# EAGLE design untitled (EAGLE 9.6.2)
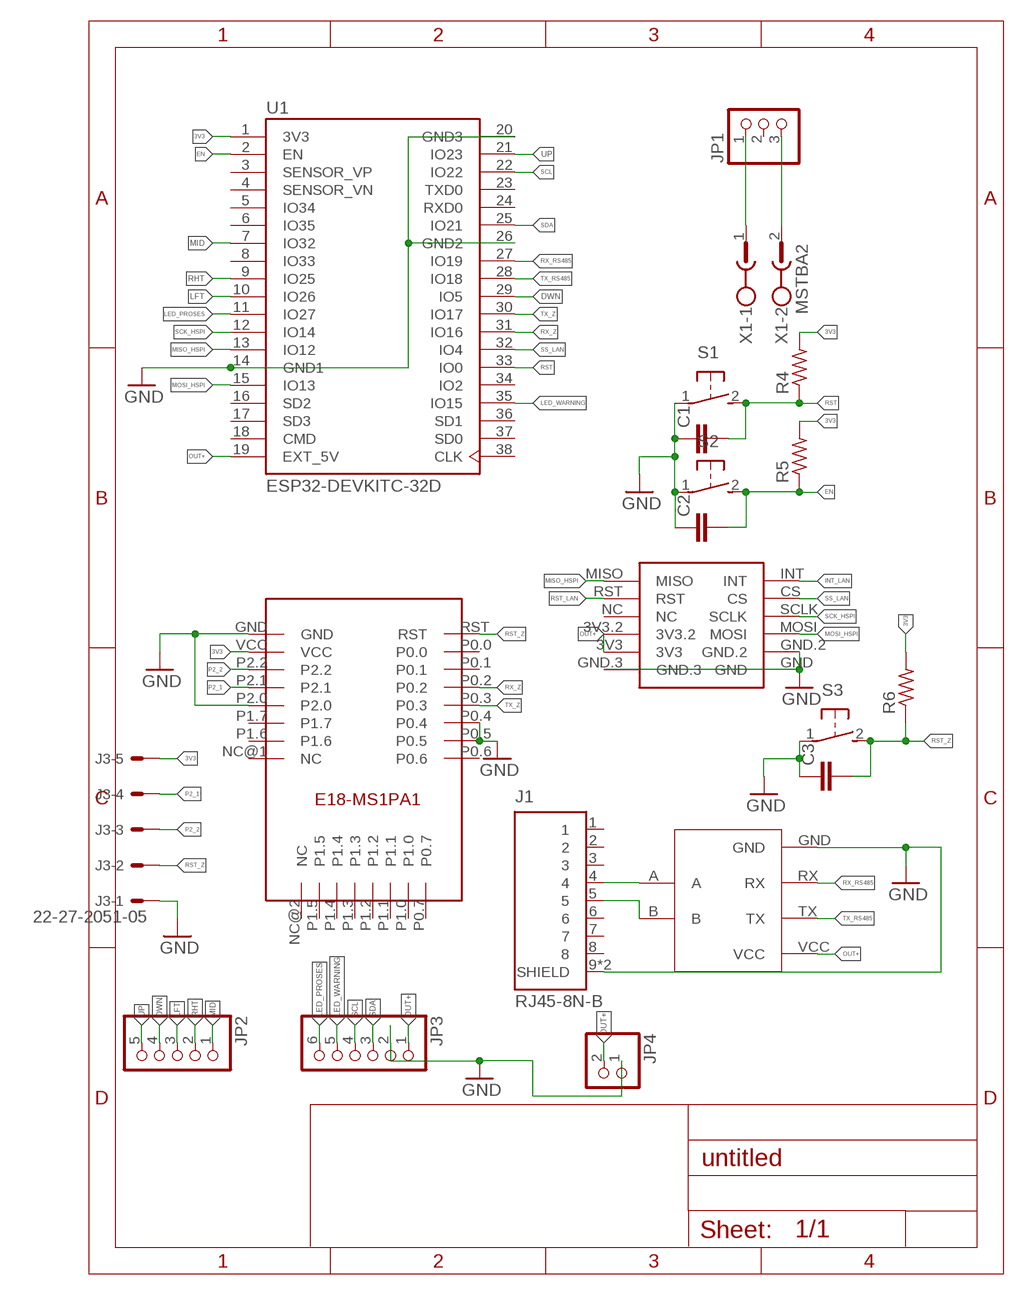
[diagram p0: schematic, sheet 1]

## Parts
C1  C-EUC0805K  [C0805K]
C2  C-EUC0805K  [C0805K]
C3  C-EUC0805K  [C0805K]
J1  RJ45-8N-B  [TE_RJ45-8N-B]
J3  22-27-2051-05  [6410-05]
JP1  PINHD-1X3  [1X03]
JP2  PINHD-1X5  [1X05]
JP3  PINHD-1X6  [1X06]
JP4  PINHD-1X2  [1X02]
R4  R-US_M0805  [M0805]
R5  R-US_M0805  [M0805]
R6  R-US_M0805  [M0805]
S1  31-XX  [B3F-31XX]
S2  31-XX  [B3F-31XX]
S3  31-XX  [B3F-31XX]
TTL-RS1  TTL-RS485  [TTL-RS485]
U1  ESP32-DEVKITC-32D  [MODULE_ESP32-DEVKITC-32D]
U$1  E18-MS1PA1IPX  [E18-MS1PA1-IPX]
U$2  MINI_W5500  [MINI_W5500]
X1  MSTBA2  [MSTBA2]

## Nets
3V3: J3.5 R4.2 R5.2 R6.2 U1.1(3V3) U$1.VCC
DWN: JP2.4 U1.29(IO5)
EN: C2.2 R5.1 S2.2(S) U1.2(EN)
GND: C1.1 C2.1 C3.1 J1.9(SHIELD) J1.10(SHIELD) J3.1 JP3.2 JP4.1 S1.1(P) S2.1(P) S3.1(P) TTL-RS1.GND U1.14(GND1) U1.20(GND3) U1.26(GND2) U$1.GND U$1.P0.4 U$1.P0.5 U$1.P2.0 U$2.GND U$2.GND.2 U$2.GND.3
INT_LAN: U$2.INT
LED_PROSES: JP3.6 U1.11(IO27)
LED_WARNING: JP3.5 U1.35(IO15)
LFT: JP2.3 U1.10(IO26)
MID: JP2.1 U1.7(IO32)
MISO_HSPI: U1.13(IO12) U$2.MISO
MOSI_HSPI: U1.15(IO13) U$2.MOSI
N$1: JP1.1 X1.1
N$2: JP1.3 X1.2
N$3: J1.4 TTL-RS1.A
N$7: J1.5 TTL-RS1.B
OUT+: JP3.1 JP4.2 TTL-RS1.VCC U1.19(EXT_5V) U$2.3V3 U$2.3V3.2
P2_1: J3.4 U$1.P2.1
P2_2: J3.3 U$1.P2.2
RHT: JP2.2 U1.9(IO25)
RST: C1.2 R4.1 S1.2(S) U1.33(IO0)
RST_LAN: U$2.RST
RST_Z: C3.2 J3.2 R6.1 S3.2(S) U$1.RST
RX_RS485: TTL-RS1.RX U1.27(IO19)
RX_Z: U1.31(IO16) U$1.P0.2
SCK_HSPI: U1.12(IO14) U$2.SCLK
SCL: JP3.4 U1.22(IO22)
SDA: JP3.3 U1.25(IO21)
SS_LAN: U1.32(IO4) U$2.CS
TX_RS485: TTL-RS1.TX U1.28(IO18)
TX_Z: U1.30(IO17) U$1.P0.3
UP: JP2.5 U1.21(IO23)
Unconnected: J1.1 J1.2 J1.3 J1.6 J1.7 J1.8 JP1.2 U1.3(SENSOR_VP) U1.4(SENSOR_VN) U1.5(IO34) U1.6(IO35) U1.8(IO33) U1.16(SD2) U1.17(SD3) U1.18(CMD) U1.23(TXD0) U1.24(RXD0) U1.34(IO2) U1.36(SD1) U1.37(SD0) U1.38(CLK) U$1.NC@1(NC) U$1.NC@2(NC) U$1.P0.0 U$1.P0.1 U$1.P0.6 U$1.P0.7 U$1.P1.0 U$1.P1.1 U$1.P1.2 U$1.P1.3 U$1.P1.4 U$1.P1.5 U$1.P1.6 U$1.P1.7 U$2.NC

## Library data of the parts
C1-C3 = rcl:C-EU: CAPACITOR, European symbol; SPICEPREFIX: C
J1 = RJ45-8N-B:RJ45-8N-B: RJ Jack / Signal Line EMI/RFI Filters 6 TERM LOW PROFILE BLOCK INDUCTOR 8 PIN Check availability <https://pricing.snapeda.com/parts/RJ45-8N-B/TE%20Connectivity/view-part?ref=eda>; AVAILABILITY: In Stock; DESCRIPTION: Jack Modular Connector 8p8c (RJ45, Ethernet) 90° Angle (Right) Unshielded -; MF: TE Connectivity; MP: RJ45-8N-B; PACKAGE: None; PRICE: None; PURCHASE-URL: https://pricing.snapeda.com/search/part/RJ45-8N-B/?ref=eda
J3 = con-molex:22-?-05: CONNECTOR wire to board 2.54 mm (.1 inch) pitch header; MF: MOLEX; OC_FARNELL: unknown; OC_NEWARK: unknown
JP1 = pinhead:PINHD-1X3: PIN HEADER
JP2 = pinhead:PINHD-1X5: PIN HEADER
JP3 = pinhead:PINHD-1X6: PIN HEADER
JP4 = pinhead:PINHD-1X2: PIN HEADER
R4-R6 = adafruit:R-US_: RESISTOR, American symbol
S1-S3 = switch-omron:31-XX: OMRON SWITCH; MPN: B3F-3100; OC_FARNELL: 959704; OC_NEWARK: 36M3582
TTL-RS1 = TTL-RS485:TTL-RS485
U1 = ESP32-DEVKITC-32D:ESP32-DEVKITC-32D: Eval Board For Esp-Wroom-32 Check availability <https://pricing.snapeda.com/parts/ESP32-DEVKITC-32D/Espressif%20Systems/view-part?ref=eda>; AVAILABILITY: In Stock; DESCRIPTION: WiFi Development Tools (802.11) ESP32 General Development Kit, ESP32-WROOM-32D on the board; MF: Espressif Systems; MP: ESP32-DEVKITC-32D; PACKAGE: None; PRICE: None; PURCHASE-URL: https://pricing.snapeda.com/search/part/ESP32-DEVKITC-32D/?ref=eda
U$1 = e18-ms1pa1-ipx:E18-MS1PA1
U$2 = ethernet-mikroavr:MINI_W5500: MINI ETHERNET W5500, CREATE BY MIKROAVR.COM
X1 = con-phoenix-508:MSTBA2: PHOENIX; MF: FARNELL; MPN: 1757242; OC_FARNELL: 3705171; OC_NEWARK: 71C4161

## Board
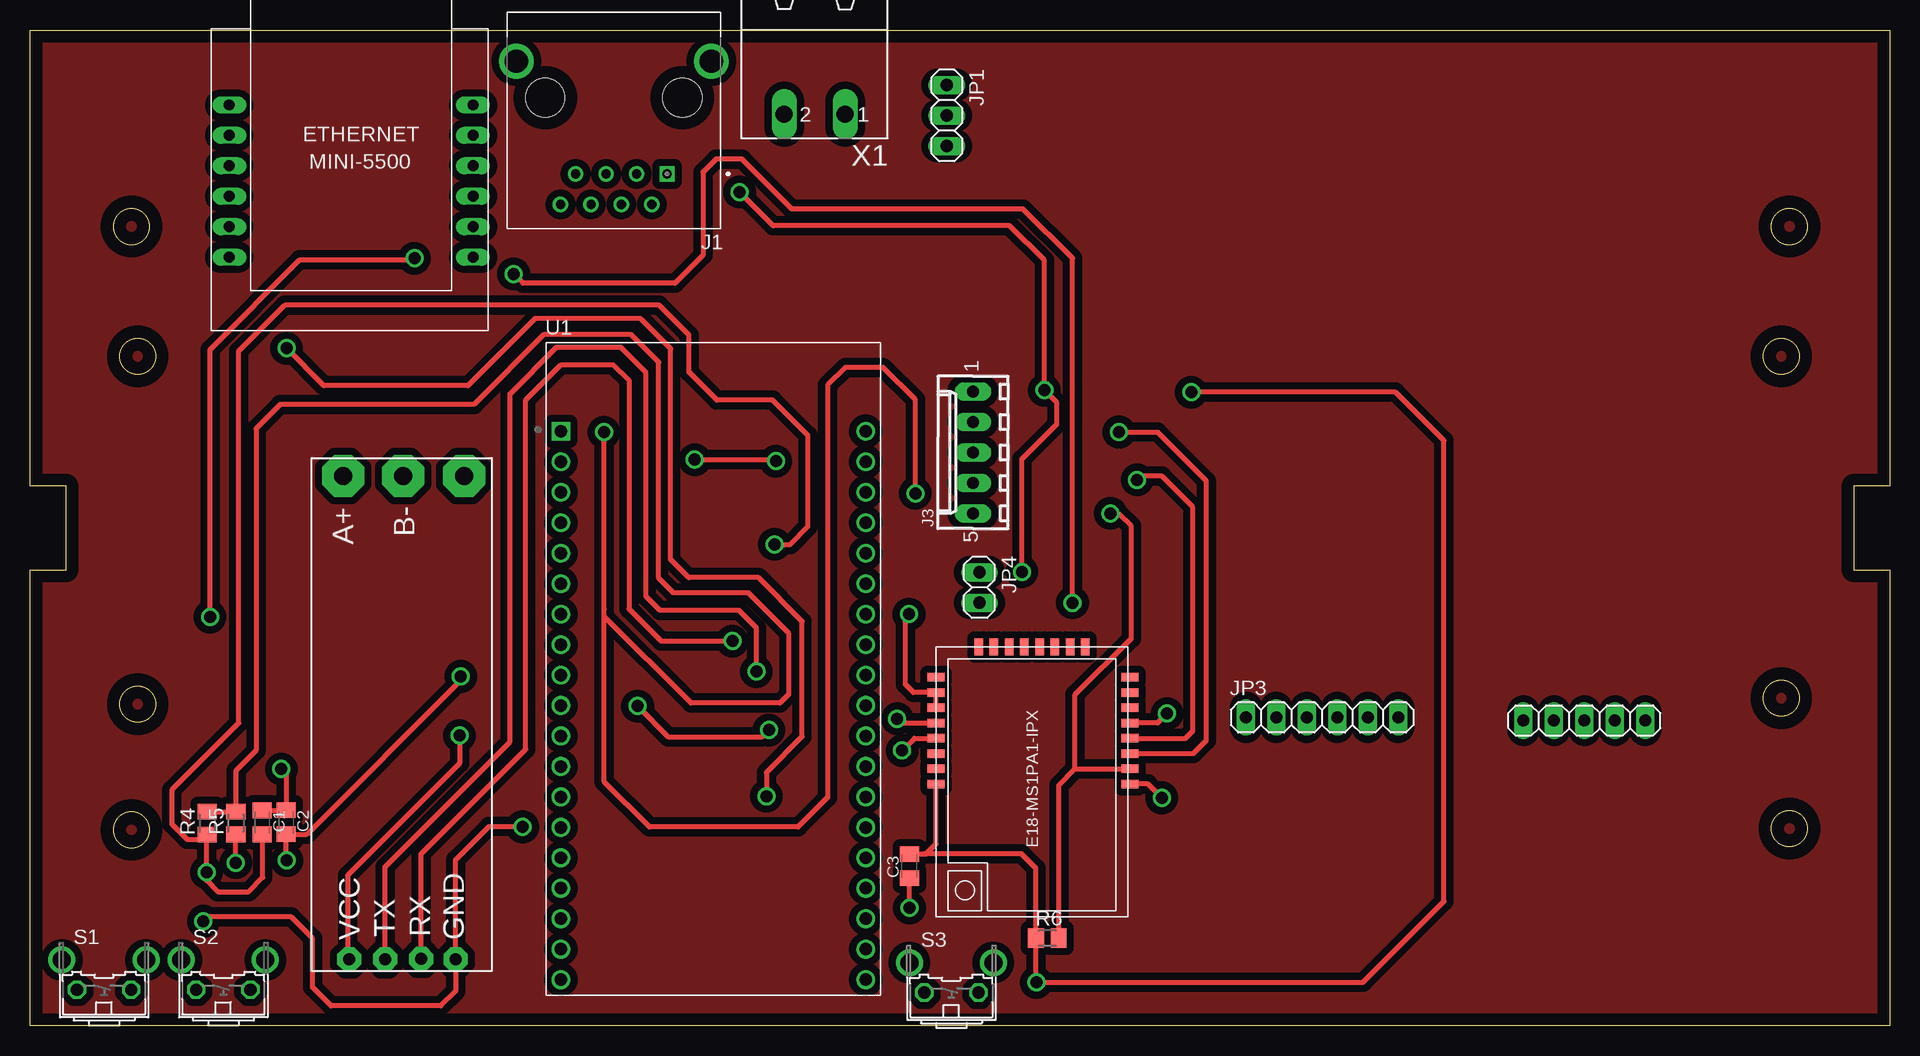
[diagram p1: board, top side]
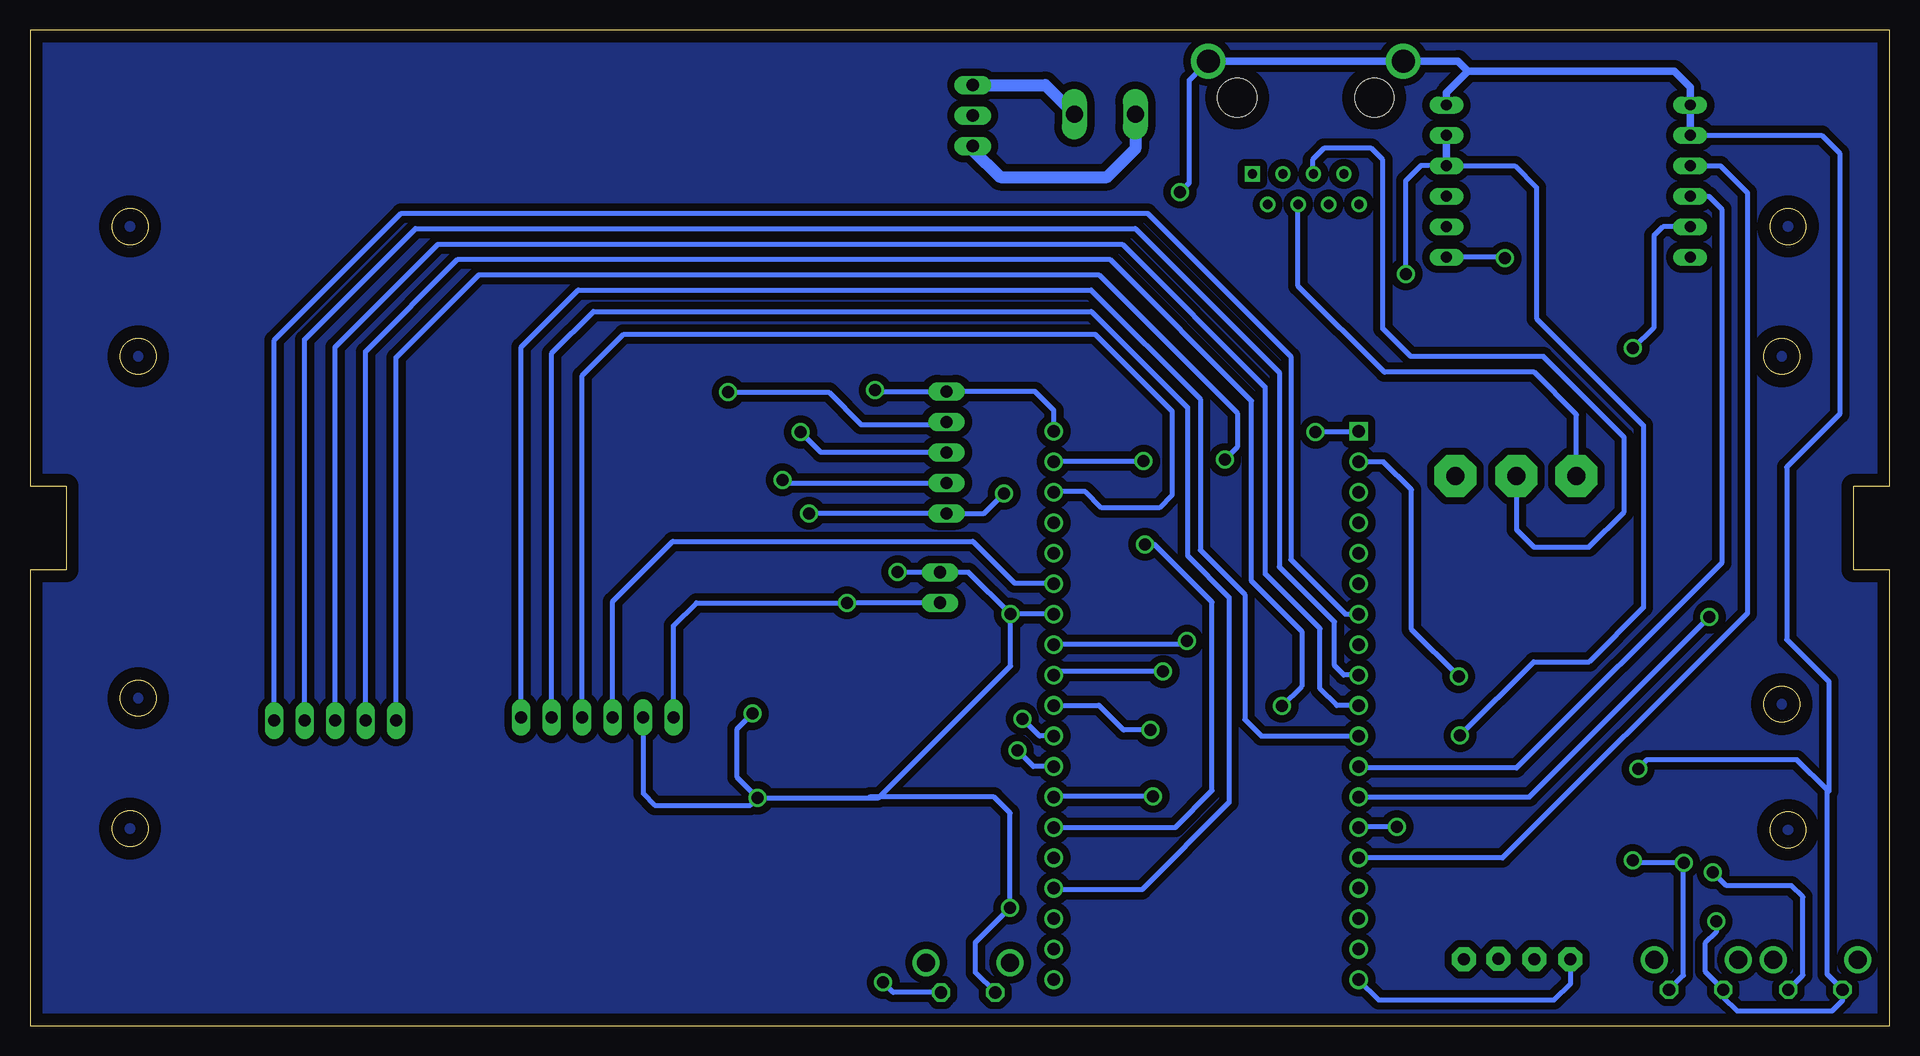
[diagram p2: board, bottom side, seen from below]

Size 155 x 83 mm. Coordinates in mm from the lower left corner, seen from the top.
Outline: 0,0 0,38 3,38 3,45 0,45 0,83 155,83 155,45 152,45 152,38 155,38 155,0 0,0
Outline: circle at 146.66,66.62 radius 1.5
Outline: circle at 146.66,16.42 radius 1.5
Outline: circle at 8.46,16.32 radius 1.5
Outline: circle at 8.46,66.62 radius 1.5
Outline: circle at 8.98,26.79 radius 1.5
Outline: circle at 8.98,55.79 radius 1.5
Outline: circle at 145.98,27.29 radius 1.5
Outline: circle at 145.98,55.79 radius 1.5
Copper layers (1*16): Top 0.035mm / dielectric 1.5mm / Bottom 0.035mm
Design rules "default": minimum track width 6mil, minimum drill 0.35mm, track to track 6mil, track to pad 6mil, pad to pad 6mil, via to via 6mil, smd to smd 6mil, copper to edge 40mil, drill to drill 6mil, minimum pad ring 10mil, minimum via ring 8mil, stop-mask expansion 4mil, vias tented up to drill 0mil, thermal gap 10mil

### Footprints (pad centres in the part's own frame; a part is rotated, then mirrored left to right if it is on the bottom)
C0805K = smd 1.3 x 1.6: 1 -1,0; 2 1,0
TE_RJ45-8N-B = drill 0.76 square: 1 -4.445,6.35 | drill 0.76: 2 -3.175,8.89; 3 -1.905,6.35; 4 -0.635,8.89; 5 0.635,6.35; 6 1.905,8.89; 7 3.175,6.35; 8 4.445,8.89 | drill 1.93: 9 -8.125,-3.05; 10 8.125,-3.05 | hole 3.25: -5.715,0; 5.715,0
6410-05 = drill 1.016 long: 1 5.08,0; 2 2.54,0; 3 0,0; 4 -2.54,0; 5 -5.08,0
1X03 = drill 1.016 long: 1 -2.54,0; 2 0,0; 3 2.54,0
1X05 = drill 1.016 long: 1 -5.08,0; 2 -2.54,0; 3 0,0; 4 2.54,0; 5 5.08,0
1X06 = drill 1.016 long: 1 -6.35,0; 2 -3.81,0; 3 -1.27,0; 4 1.27,0; 5 3.81,0; 6 6.35,0
1X02 = drill 1.016 long: 1 -1.27,0; 2 1.27,0
M0805 = smd 1.3 x 1.6: 1 -0.95,0; 2 0.95,0
B3F-31XX = drill 1.016 octagon: 1 -2.261,-1.245; 2 2.261,-1.245 | drill 1.499 pad 2.159: 3 -3.505,1.245; 4 3.505,1.245
TTL-RS485 = drill 1.5 pad 3.5 octagon: A -19.7,-6; B -19.7,-1; P$7 -19.7,4.1 | drill 1 pad 2 octagon: GND 20.6,3.37; RX 20.581,0.505; TX 20.583,-2.493; VCC 20.6,-5.47
MODULE_ESP32-DEVKITC-32D = drill 1.04 square: 1 -12.7,19.76 | drill 1.04: 2 -12.7,17.22; 3 -12.7,14.68; 4 -12.7,12.14; 5 -12.7,9.6; 6 -12.7,7.06; 7 -12.7,4.52; 8 -12.7,1.98; 9 -12.7,-0.56; 10 -12.7,-3.1; 11 -12.7,-5.64; 12 -12.7,-8.18; 13 -12.7,-10.72; 14 -12.7,-13.26; 15 -12.7,-15.8; 16 -12.7,-18.34; 17 -12.7,-20.88; 18 -12.7,-23.42; 19 -12.7,-25.96; 20 12.7,19.76; 21 12.7,17.22; 22 12.7,14.68; 23 12.7,12.14; 24 12.7,9.6; 25 12.7,7.06; 26 12.7,4.52; 27 12.7,1.98; 28 12.7,-0.56; 29 12.7,-3.1; 30 12.7,-5.64; 31 12.7,-8.18; 32 12.7,-10.72; 33 12.7,-13.26; 34 12.7,-15.8; 35 12.7,-18.34; 36 12.7,-20.88; 37 12.7,-23.42; 38 12.7,-25.96
E18-MS1PA1-IPX = smd 0.711 x 1.422: GND 11.44,16.14; NC@1 2.55,16.14; P0.0 10.17,0; P0.1 8.9,0; P0.2 7.63,0; P0.3 6.36,0; P0.4 5.09,0; P0.5 3.82,0; P0.6 2.55,0; P1.6 3.82,16.14; P1.7 5.09,16.14; P2.0 6.36,16.14; P2.1 7.63,16.14; P2.2 8.9,16.14; RST 11.44,0; VCC 10.17,16.14 | smd 1.422 x 0.711: NC@2 0,12.44; P0.7 0,3.55; P1.0 0,4.82; P1.1 0,6.09; P1.2 0,7.36; P1.3 0,8.63; P1.4 0,9.9; P1.5 0,11.17
MINI_W5500 = drill 0.914 long: 3V3 21.844,-8.89; 3V3.2 21.844,-11.43; CS 1.524,-16.51; GND 1.524,-6.35; GND.2 1.524,-8.89; GND.3 21.844,-6.35; INT 1.524,-19.05; MISO 21.844,-19.05; MOSI 1.524,-11.43; NC 21.844,-13.97; RST 21.844,-16.51; SCLK 1.524,-13.97
MSTBA2 = drill 1.397 long: 1 -2.54,5.08; 2 2.54,5.08

### Placement (x,y rotation side)
C1  19.35,16.94 270 top
C2  21.35,16.95 270 top
C3  73.3,13.3 90 top
J1  48.66,77.35 180 top
J3  78.6,47.78 90 top
JP1  76.42,75.87 270 top
JP2  129.57,25.42 180 top
JP3  107.7,25.69 0 top
JP4  79.14,36.52 270 top
R4  14.77,16.87 90 top
R5  17.17,16.89 90 top
R6  84.8,7.3 0 top
S1  6.17,4.23 0 top
S2  16.11,4.23 0 top
S3  76.8,4 0 top
TTL-RS1  32.09,26.12 270 top
U1  56.96,29.78 0 top
U$1  75.53,31.58 270 top
U$2  15.09,83.1 0 top
X1  65.4,81.06 180 top

### Tracks (layer width: path | path; a pad name or v marks a point on that pad's centre or on a via)
3V3  (via drill 1)
  Top 0.406: R4.2 17.15,17.82 R5.2 17.17,21.27 18.85,22.95 18.85,49.75 20.87,51.78 37,51.78 42.82,57.59 50.12,57.59 52.4,55.31 52.4,37.3 53.63,36.07 59.88,36.07 63.27,32.68 63.27,27.64 62.52,26.88 55.1,26.88 47.86,34.12 | 47.86,34.12 47.86,34.72 47.86,49.43 v47.83,49.46 | R6.2 85.75,20.04 87.12,21.41 | 87.12,21.41 U$1.VCC | 87.12,21.41 87.12,27.59 91.8,32.27 91.8,41.63 90.81,42.61 89.98,42.61 v90.07,42.7 | v73.8,44.37 73.8,52.18 71.11,54.88 67.97,54.88 66.49,53.39 66.49,19.01 64.02,16.54 51.64,16.54 47.86,20.32 47.86,34.12
  Bottom 0.406: v47.83,49.46 47.76,49.54 U1.1 | v90.07,42.7 J3.5 75.47,42.7 v73.8,44.37
DWN  (via drill 1)
  Top 0.406: v50.64,26.63 53.21,24.07 61.03,24.07 v61.59,24.63
  Bottom 0.406: JP2.4 127.03,56.2 119.34,63.89 65,63.89 53.19,52.07 53.19,37.05 49,32.86 49,28.27 v50.64,26.63 | U1.29 65.92,26.69 63.85,24.63 v61.59,24.63
EN  (via drill 1)
  Top 0.406: v17.15,13.58 17.15,15.92 R5.1 | v21.41,13.76 21.35,13.82 C2.2 23.1,15.95 35.91,28.76 v35.91,29.1
  Bottom 0.406: S2.2 17.18,4.18 17.18,13.55 v17.15,13.58 21.23,13.58 v21.41,13.76 | v35.91,29.1 39.84,33.03 39.84,44.67 42.17,47 U1.2
GND  (via drill 1)
  Top 0.406: C1.1 C2.1 | C2.1 | U$1.P0.4 U$1.P0.5 73.63,27.76 72.97,28.42 72.97,34.01 73.35,34.39 73.35,34.38 v73.27,34.3 | v73.31,9.81 73.31,12.29 C3.1 | v41.06,16.57 41.03,16.59 38.26,16.59 35.46,13.8 TTL-RS1.GND 35.46,2.85 34.24,1.63 25.09,1.63 23.55,3.17 23.55,7.25 21.76,9.05 14.81,9.05 v14.45,8.69 | v94.34,18.98 93.18,20.14 U$1.GND | v94.78,26.01 93.99,25.22 U$1.P2.0 | v82.67,37.83 82.67,47.22 85.59,50.13 85.59,51.93 v84.54,52.97 84.54,63.8 81.67,66.68 61.95,66.68 v59.14,69.48 | v59.14,69.48 | v20.95,21.39 21.34,20.99 C2.1
  Bottom 0.406: S3.1 76.19,4.4 76.19,6.93 v73.31,9.81 73.31,17.71 74.66,19.06 84.99,19.06 85.06,18.98 | 69.73,49.61 U1.20 69.66,51.28 71.23,52.86 78.56,52.86 | v41.06,16.57 44.21,16.57 U1.14 | 78.56,52.86 J3.1 84.43,52.86 v84.54,52.97 | 78.56,52.86 | JP3.2 103.89,19.34 102.92,18.37 94.96,18.37 v94.34,18.98 | v94.34,18.98 96.06,20.69 96.06,24.74 v94.78,26.01 | U1.26 v73.27,34.3 | v73.27,34.3 76.76,37.79 JP4.1 82.63,37.79 v82.67,37.83 | v59.14,69.48 58.36,70.26 58.36,78.82 J1.9 | v94.34,18.98 85.06,18.98 | 85.06,18.98 84.25,18.98 73.27,29.96 v73.27,34.3 | v20.95,21.39 20.95,21.43 20.23,22.15 7.71,22.15 5.2,19.64 5.2,19.4 | 5.2,19.4 5.2,4.28 S1.1 3.91,2.09 4.78,1.22 12.69,1.22 13.85,2.37 S2.1 15.39,4.53 15.39,6.85 14.45,7.79 v14.45,8.69 | U$2.GND.2 5.65,74.21 4.15,72.72 4.15,50.97 8.58,46.55 8.58,32.19 5.06,28.67 5.06,19.54 5.2,19.4
  Bottom 0.61: U$2.GND.2 U$2.GND 16.61,78.24 17.94,79.56 35.13,79.56 | U$2.GND.3 36.93,77.76 35.13,79.56 | 35.13,79.56 35.97,80.4 J1.10 J1.9
LED_PROSES
  Bottom 0.406: JP3.6 114.05,56.56 109.3,61.32 66.55,61.32 57.45,52.21 57.45,39.64 53.73,35.92 53.73,25.52 52.36,24.14 U1.11
LED_WARNING
  Bottom 0.406: JP3.5 111.51,56.06 108.04,59.53 66.52,59.53 58.52,51.53 58.52,39.18 55.05,35.71 55.05,18.59 62.31,11.32 69.54,11.32 U1.35
LFT
  Bottom 0.406: JP2.3 129.57,56.55 120.99,65.13 63.95,65.13 52.05,53.24 52.05,37.68 47.47,33.09 47.47,28.07 46.08,26.68 U1.10 44.44,26.68
MID
  Bottom 0.406: JP2.1 134.65,57.13 124.06,67.72 61.84,67.72 49.91,55.78 49.91,38.84 45.36,34.3 U1.7
MISO_HSPI  (via drill 1)
  Top 0.406: v15,34.06 15,56.35 22.49,63.84 31.93,63.84 v32.05,63.96
  Bottom 0.406: 44.32,19 U1.13 30.01,19.06 v15,34.06 | v32.05,63.96 32.13,64.05 U$2.MISO
MOSI_HSPI
  Bottom 0.406: U$2.MOSI 14.1,71.67 11.85,69.42 11.85,34.37 32.25,13.96 44.24,13.96 U1.15
N$1
  Bottom 1.016: JP1.1 70.37,78.41 X1.1
N$2
  Bottom 1.016: JP1.3 76.42,73.03 74.12,70.73 65.22,70.73 63.5,72.45 62.86,73.09 X1.2
N$3
  Bottom 0.406: TTL-RS1.A 26.09,50.93 29.62,54.46 42.1,54.46 49.3,61.66 J1.4
N$7
  Bottom 0.406: TTL-RS1.B 31.09,41.34 29.63,39.88 25.05,39.88 22.11,42.83 22.11,49.03 28.85,55.78 39.91,55.78 42.24,58.1 42.24,72.17 43.2,73.14 47.13,73.14 48.09,72.18 48.09,71.06 J1.5
N$8
  pour Bottom (isolate 0.61): 0,83 155,83 155,45 152,45 152,38 155,38 155,0 0,0 0,38 3,38 3,45 0,45
N$9
  pour Top (isolate 0.61): 0,83 155,83 155,45 152,45 152,38 155,38 155,0 0,0 0,38 3,38 3,45 0,45
OUT+  (via drill 1)
  Top 0.406: v35.8,24.17 35.8,21.84 26.47,12.5 26.47,5.68 TTL-RS1.VCC | v86.9,35.25 86.9,63.97 82.79,68.08 63.5,68.08 59.35,72.23 57.19,72.23 56.1,71.15 56.1,64.23 53.76,61.88 41.09,61.88 v40.32,62.66
  Bottom 0.406: U1.19 42.57,2.13 27.96,2.13 26.58,3.51 26.58,5.48 TTL-RS1.VCC | JP3.1 101.35,33.35 99.46,35.25 v86.9,35.25 JP4.2 | v35.8,24.17 29.66,30.32 25.04,30.32 20.5,34.85 20.5,50.03 29.43,58.95 29.43,69.87 31.23,71.67 U$2.3V3.2 36.98,71.71 39.02,71.71 40.32,70.42 v40.32,62.66
  Bottom 0.61: U$2.3V3.2 U$2.3V3
P2_1  (via drill 1)
  Top 0.406: U$1.P2.1 96.32,23.95 96.92,24.55 96.92,43.22 94.33,45.8 92.59,45.8 v92.29,45.5
  Bottom 0.406: v92.29,45.5 92.03,45.24 J3.4
P2_2  (via drill 1)
  Top 0.406: U$1.P2.2 96.97,22.68 98.04,23.75 98.04,45.41 93.98,49.48 v90.77,49.48
  Bottom 0.406: J3.3 89.07,47.78 v90.77,49.48
RHT
  Bottom 0.406: JP2.2 132.11,57.2 122.86,66.45 62.86,66.45 50.86,54.45 50.86,38.24 46.27,33.66 46.27,30.01 45.48,29.22 U1.9 44.52,29.22
RST  (via drill 1)
  Top 0.406: C1.2 19.41,15.88 19.41,12.33 18.25,11.16 15.65,11.16 14.72,12.1 v14.72,12.78 14.72,15.87 R4.1 14.37,15.52 13.12,15.52 11.82,16.81 11.82,19.64 17.41,25.23 17.41,56.24 21.23,60.06 52.45,60.06 54.92,57.58 54.92,54.47 57.25,52.15 61.91,52.15 64.85,49.2 64.85,41.59 63.38,40.11 v62.06,40.11
  Bottom 0.406: S1.2 7.23,4.19 7.23,10.71 8.18,11.66 13.6,11.66 v14.72,12.78 | U1.33 59.54,16.52 56.47,19.59 56.47,35.3 61.28,40.11 v62.06,40.11
RST_Z  (via drill 1)
  Top 0.406: C3.2 74.46,14.3 | 74.46,14.3 74.69,14.3 75.53,15.14 U$1.RST | 74.46,14.3 74.5,14.33 82.64,14.33 83.85,13.12 R6.1 83.85,3.62 v83.89,3.59 111.09,3.59 117.86,10.35 117.86,48.76 113.81,52.81 v96.8,52.81
  Bottom 0.406: S3.2 83.06,2.75 v83.89,3.59 | v83.89,3.59 | v96.8,52.81 88.42,52.81 85.71,50.1 78.82,50.1 J3.2
RX_RS485  (via drill 1)
  Top 0.406: TTL-RS1.RX 32.6,14.3 41.33,23.04 41.33,52.16 44.28,55.1 48.62,55.1 49.92,53.8 49.92,34.73 52.6,32.05 v58.55,32.05
  Bottom 0.406: v58.55,32.05 58.84,31.76 U1.27
RX_Z  (via drill 1)
  Top 0.406: v72.7,22.93 73.72,23.95 U$1.P0.2
  Bottom 0.406: U1.31 71.37,21.6 v72.7,22.93
SCK_HSPI
  Bottom 0.406: U$2.SCLK 15.05,69.13 14,68.07 14,38.56 31.09,21.47 44.13,21.47 U1.12
SCL
  Bottom 0.406: JP3.4 108.97,54.18 105.52,57.64 66.22,57.64 59.8,51.22 59.8,44.23 60.87,43.16 65.69,43.16 67.03,44.51 69.61,44.51 U1.22
SDA
  Bottom 0.406: U1.25 69.71,36.89 72.93,36.89 76.4,40.36 101.44,40.36 106.43,35.36 JP3.3
SS_LAN  (via drill 1)
  Top 0.406: v61.38,19.11 61.38,21.09 64.37,24.09 64.37,33.69 60.72,37.34 54.9,37.34 53.4,38.84 53.4,56.43 50.89,58.94 42.11,58.94 36.52,53.35 24.5,53.35 v21.38,56.47
  Bottom 0.406: v21.38,56.47 19.64,58.21 19.64,65.84 18.89,66.59 U$2.CS | v61.38,19.11 69.61,19.11 U1.32
TX_RS485  (via drill 1)
  Top 0.406: TTL-RS1.TX 29.6,13.24 40.01,23.65 40.01,52.67 43.88,56.54 49.23,56.54 51.34,54.43 51.34,35.78 52.51,34.61 59.09,34.61 60.55,33.16 v60.55,29.5
  Bottom 0.406: v60.55,29.5 69.38,29.5 U1.28
TX_Z  (via drill 1)
  Top 0.406: v72.28,25.57 72.64,25.22 U$1.P0.3
  Bottom 0.406: U1.30 70.85,24.14 v72.28,25.57
UP  (via drill 1)
  Top 0.406: v55.41,47.18 62.05,47.18 v62.18,47.05
  Bottom 0.406: JP2.5 124.49,55.69 117.58,62.6 65.9,62.6 54.36,51.06 54.36,48.23 v55.41,47.18 | U1.21 69.61,47.05 v62.18,47.05